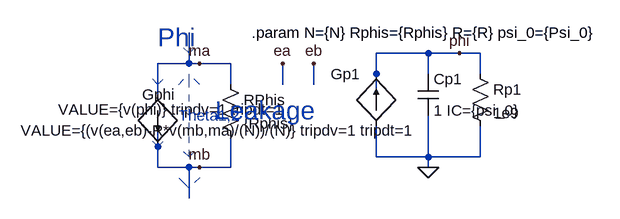
[diagram p0: schematic wicklung.asc]
wicklung.asc, the LTspice schematic file:
Version 4
SHEET 1 880 680
WIRE 464 96 384 96
WIRE 512 96 464 96
WIRE 544 96 512 96
WIRE 96 112 96 64
WIRE 96 112 48 112
WIRE 112 112 96 112
WIRE 160 112 112 112
WIRE 464 128 464 96
WIRE 544 128 544 96
WIRE 160 144 160 112
WIRE 240 144 240 112
WIRE 288 144 288 112
WIRE 48 160 48 112
WIRE 384 160 384 96
WIRE 384 256 384 208
WIRE 464 256 464 192
WIRE 464 256 384 256
WIRE 544 256 544 208
WIRE 544 256 464 256
WIRE 48 272 48 208
WIRE 96 272 48 272
WIRE 112 272 96 272
WIRE 160 272 160 224
WIRE 160 272 112 272
WIRE 464 272 464 256
WIRE 96 320 96 272
FLAG 112 112 ma
FLAG 112 272 mb
FLAG 240 112 ea
FLAG 288 112 eb
FLAG 464 272 0
FLAG 512 96 phi
SYMBOL bi 48 160 R0
WINDOW 3 -153 23 Left 2
WINDOW 0 -24 0 Left 2
SYMATTR Value VALUE={v(phi)} tripdv=1 tripdt=1
SYMATTR InstName Gphi
SYMATTR Prefix G
SYMBOL res 144 128 R0
SYMATTR InstName RPhis
SYMATTR Value {Rphis}
SYMBOL bi 384 208 R180
WINDOW 0 24 80 Left 2
WINDOW 3 -68 -7 Left 2
SYMATTR InstName Gp1
SYMATTR Value VALUE={(v(ea,eb)-R*v(mb,ma)/(N))/(N)} tripdv=1 tripdt=1
SYMATTR Prefix G
SYMBOL cap 448 128 R0
SYMATTR InstName Cp1
SYMATTR Value 1 IC={psi_0}
SYMBOL res 528 112 R0
SYMATTR InstName Rp1
SYMATTR Value 1e9
TEXT 192 64 Left 2 !.param N={N} Rphis={Rphis} R={R} psi_0={Psi_0}
TEXT 136 184 Left 4 ;Leakage
TEXT 48 72 Left 4 ;Phi
TEXT 80 192 Left 2 ;Theta1,2
LINE Normal 80 288 96 304 2
LINE Normal 96 304 80 288 2
LINE Normal 112 288 96 304 2
LINE Normal 96 96 80 80 2
LINE Normal 96 96 112 80 2
LINE Normal 48 144 32 128 2
LINE Normal 48 144 64 128 2
LINE Normal 48 240 32 224 2
LINE Normal 48 240 64 224 2
LINE Normal 96 256 96 128 2
LINE Normal 96 144 96 128 2
LINE Normal 80 144 96 128 2
LINE Normal 112 144 96 128 2
LINE Normal 96 256 112 240 2
LINE Normal 96 256 80 240 2

The netlist it stands for:
* wicklung.asc
Gphi ma mb VALUE={v(phi)} tripdv=1 tripdt=1
RPhis ma mb {Rphis}
Gp1 0 phi VALUE={(v(ea,eb)-R*v(mb,ma)/(N))/(N)} tripdv=1 tripdt=1
Cp1 phi 0 1 IC={psi_0}
Rp1 phi 0 1e9
.param N={N} Rphis={Rphis} R={R} psi_0={Psi_0}
* Leakage
* Phi
* Theta1,2
.backanno
.end